# Altium schematic sheet Virtex_II_PRO_PSU.SchDoc
size A4; DocumentNumber: 1; Revision: 1.01; SheetNumber: 1; SheetTotal: 3
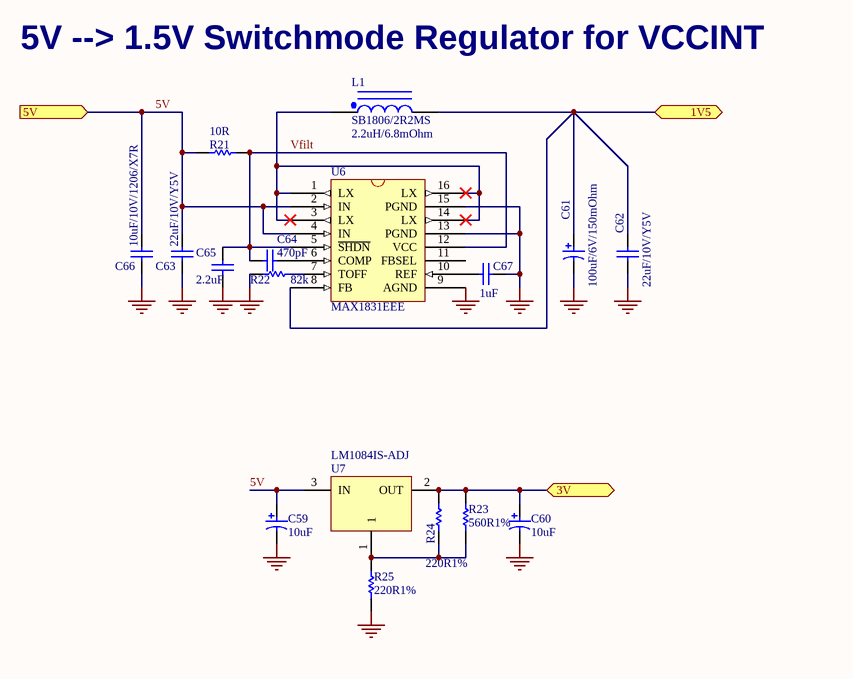
[diagram p0: Virtex_II_PRO_PSU.SchDoc]

## Parts
C59  10uF  [MCCT-B]
C60  10uF  [MCCT-B]
C61  100uF/6V/150mOhm  [MCCT-D]
C62  22uF/10V/Y5V  [CC3225-1210]
C63  22uF/10V/Y5V  [CC3225-1210]
C64  470pF  [CC1608-0603]
C65  2.2uF  [CC3216-1206]
C66  10uF/10V/1206/X7R  [CC3216-1206]
C67  1uF  [CC3216-1206]
L1  SB1806/2R2MS  value 2.2uH/6.8mOhm  [IND SB1806]
R21  10R  [CC2012-0805]
R22  82k  [CC2012-0805]
R23  560R1%  [CC2012-0805]
R24  220R1%  [CC2012-0805]
R25  220R1%  [CC2012-0805]
U6  MAX1831EEE  [QSOP16_150_25]
U7  LM1084IS-ADJ  [TO-263]

## Ports
1V5, 3V, 5V (in)

## Nets
GND: C59.2 C60.2 C61.2 C62.1 C63.1 C65.1 C66.1 C67.2 R22.1 R25.2 U6.9(AGND) U6.13(PGND) U6.15(PGND)
1V5: C61.1 C62.2 L1.2 U6.8(FB) ; port 1V5
3V: C60.1 R23.1 R24.1 U7.2(OUT) ; port 3V
5V: C59.1 C63.2 C66.2 R21.2 U6.2(IN) U6.4(IN) U7.3(IN) ; port 5V
Vfilt: C64.1 C65.2 R21.1 U6.5(~{SHDN}) U6.12(VCC)
NetC64_2: C64.2 U6.6(COMP)
NetC67_1: C67.1 U6.10(REF)
NetL1_1: L1.1 U6.1(LX) U6.3(LX) U6.14(LX) U6.16(LX)
NetR22_2: R22.2 U6.7(TOFF)
NetR23_2: R23.2 R24.2 R25.1 U7.1

Not connected (* = marked no-connect by the designer): U6 11(FBSEL)

## Notes on the sheet
- 5V --> 1.5V Switchmode Regulator for VCCINT
- Title
- Size:
- Date:
- A4
- Number:
- Time:
- Revision:
- Sheet
- of
- File:

## Library data of the parts
C59-C61 = CAP_POLAR: Polar Capacitor
  C59 C60: Supplier: FARNELL; Supplier Code: 967-117
  C61: Supplier: RS; Supplier Code: 262-4737
C62-C67 = CAP: Capacitor
  C62 C63: Supplier: RS; Supplier Code: 312-3128
  C64: Supplier: FARNELL; Supplier Code: 316-672
  C65: Supplier: RS; Supplier Code: 264-4220
  C66: Supplier: RS; Supplier Code: 367-3437
  C67: Supplier: FARNELL; Supplier Code: 422-7068
L1 = Inductor Iron Dot: Magnetic-Core Inductor with Winding Polarity Marking; Published: 24-Mar-1999; Revision: July-2002: Re-released for DXP Platform.; Publisher: Altium Limited; Supplier: ABC Components; Supplier Code: SB1806 2R2MS
R21-R25 = RES: Resistor
U6 = MAX1831EEE: 3A,!MHz, Low Voltage, Step-Down Regulator with Synchronous Rectification and Internal Switches; Supplier: Arrow; Supplier Code: MAX1831EEE
U7 = LM1084IS-ADJ: 5A Low Dropout Positive Regulators; Manufacturer: National Semi; Published: 5-Jan-2004; Datasheet: Latest Revision: Aug-2002; Publisher: Altium Limited